# EAGLE schematic NinjaPool-171004 (EAGLE 6.6.0)
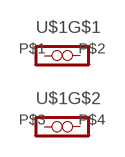
[diagram p0: schematic, sheet 1]

## Parts
U$1  BANANA  [BANANA_TMP]
Unconnected: U$1.P$1 U$1.P$2 U$1.P$3 U$1.P$4

## Library data of the parts
U$1 = PCR-Connector:BANANA